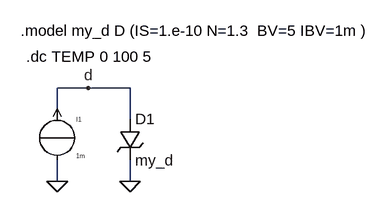
[diagram p0: schematic diode_1.asc]
diode_1.asc, the LTspice schematic file:
Version 4
SHEET 1 880 680
WIRE 176 96 128 96
WIRE 240 96 176 96
WIRE 128 128 128 96
WIRE 240 144 240 96
WIRE 128 240 128 208
WIRE 240 240 240 208
FLAG 240 240 0
FLAG 128 240 0
FLAG 176 96 d
SYMBOL zener 224 144 R0
SYMATTR InstName D1
SYMATTR Value my_d
SYMATTR Description Diode
SYMATTR Type diode
SYMBOL source-I 128 128 R0
SYMATTR InstName I1
SYMATTR Value 1m
TEXT 80 48 Left 2 !.dc TEMP 0 100 5
TEXT 72 8 Left 2 !.model my_d D (IS=1.e-10 N=1.3  BV=5 IBV=1m )

The netlist it stands for:
* diode_1.asc
D1 d 0 my_d
I1 0 d 1m
.model D D
.lib standard.dio
.dc TEMP 0 100 5
.model my_d D (IS=1.e-10 N=1.3  BV=5 IBV=1m )
.backanno
.end